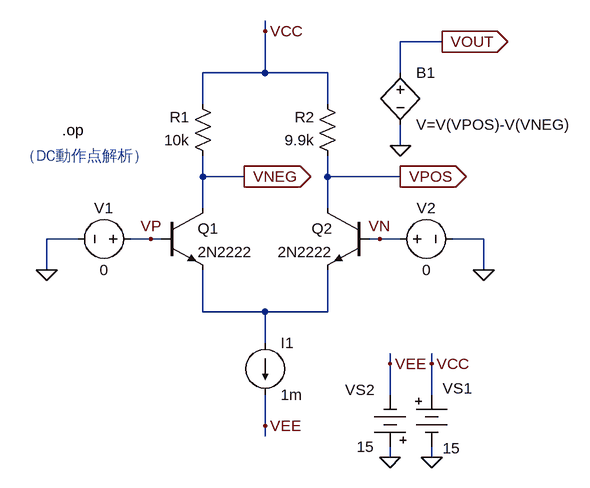
[diagram p0: schematic fig-02-01-11(b).asc]
fig-02-01-11(b).asc, the LTspice schematic file:
Version 4
SHEET 1 880 680
WIRE 144 -48 144 -64
WIRE 416 -32 352 -32
WIRE 144 16 144 -48
WIRE 144 16 48 16
WIRE 240 16 144 16
WIRE 352 16 352 -32
WIRE 48 64 48 16
WIRE 240 64 240 16
WIRE 352 128 352 96
WIRE 48 176 48 144
WIRE 112 176 48 176
WIRE 240 176 240 144
WIRE 352 176 240 176
WIRE 48 224 48 176
WIRE 240 224 240 176
WIRE -144 272 -192 272
WIRE -32 272 -64 272
WIRE -16 272 -32 272
WIRE 320 272 304 272
WIRE 352 272 320 272
WIRE 480 272 432 272
WIRE -192 320 -192 272
WIRE 480 320 480 272
WIRE 48 384 48 320
WIRE 144 384 48 384
WIRE 240 384 240 320
WIRE 240 384 144 384
WIRE 144 432 144 384
WIRE 336 464 336 448
WIRE 400 464 400 448
WIRE 336 512 336 464
WIRE 400 512 400 464
WIRE 144 560 144 512
WIRE 144 576 144 560
WIRE 336 608 336 592
WIRE 400 608 400 592
FLAG -192 320 0
FLAG 336 608 0
FLAG 400 608 0
FLAG 336 464 VEE
FLAG 400 464 VCC
FLAG 352 176 VPOS
IOPIN 352 176 Out
FLAG 144 560 VEE
FLAG 144 -48 VCC
FLAG 480 320 0
FLAG 112 176 VNEG
IOPIN 112 176 Out
FLAG 352 128 0
FLAG 416 -32 VOUT
IOPIN 416 -32 Out
FLAG -32 272 VP
FLAG 320 272 VN
SYMBOL Misc\\battery 400 496 R0
WINDOW 0 17 6 Left 2
WINDOW 3 17 98 Left 2
SYMATTR InstName VS1
SYMATTR Value 15
SYMBOL Misc\\battery 336 608 R180
WINDOW 0 24 104 Left 2
WINDOW 3 24 16 Left 2
SYMATTR InstName VS2
SYMATTR Value 15
SYMBOL res 64 160 R180
WINDOW 0 36 76 Left 2
WINDOW 3 36 40 Left 2
SYMATTR InstName R1
SYMATTR Value 10k
SYMBOL npn -16 224 R0
SYMATTR InstName Q1
SYMATTR Value 2N2222
SYMBOL npn 304 224 M0
SYMATTR InstName Q2
SYMATTR Value 2N2222
SYMBOL current 144 432 R0
WINDOW 123 0 0 Left 0
WINDOW 39 0 0 Left 0
SYMATTR InstName I1
SYMATTR Value 1m
SYMBOL res 256 160 R180
WINDOW 0 36 76 Left 2
WINDOW 3 36 40 Left 2
SYMATTR InstName R2
SYMATTR Value 9.9k
SYMBOL voltage -48 272 R90
WINDOW 0 -32 56 VBottom 2
WINDOW 3 32 56 VTop 2
SYMATTR InstName V1
SYMATTR Value 0
SYMBOL voltage 336 272 R270
WINDOW 0 32 56 VTop 2
WINDOW 3 -32 56 VBottom 2
SYMATTR InstName V2
SYMATTR Value 0
SYMBOL bv 352 0 R0
SYMATTR InstName B1
SYMATTR Value V=V(VPOS)-V(VNEG)
TEXT -168 104 Left 2 !.op
TEXT -232 144 Left 2 ;（DC動作点解析）

The netlist it stands for:
* fig-02-01-11(b).asc
VS1 VCC 0 15
VS2 0 VEE 15
R1 VNEG VCC 10k
Q1 VNEG VP N001 0 2N2222
Q2 VPOS VN N001 0 2N2222
I1 N001 VEE 1m
R2 VPOS VCC 9.9k
V1 VP 0 0
V2 VN 0 0
B1 VOUT 0 V=V(VPOS)-V(VNEG)
.model NPN NPN
.model PNP PNP
.lib standard.bjt
.op
* （DC動作点解析）
.backanno
.end